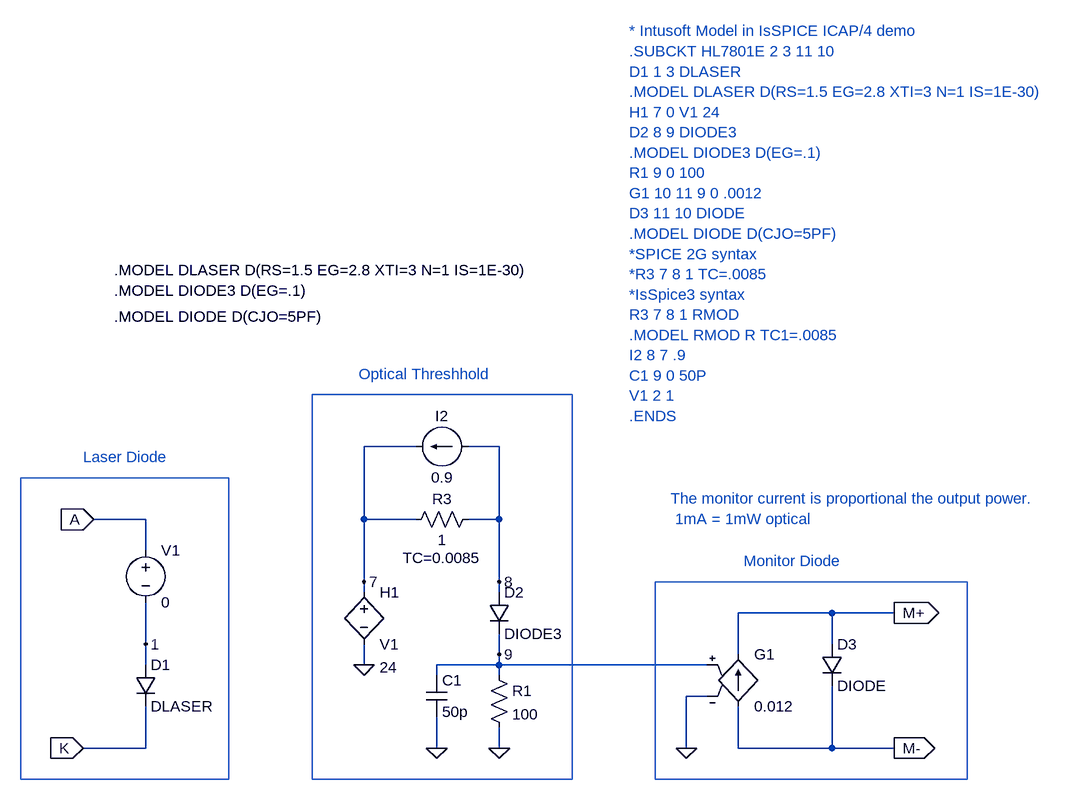
[diagram p0: schematic ld_hl7801e.asc]
ld_hl7801e.asc, the LTspice schematic file:
Version 4
SHEET 1 1556 1100
WIRE 16 288 16 256
WIRE 16 352 16 416
WIRE 16 256 16 192
WIRE 352 288 352 256
WIRE 352 176 352 160
WIRE 352 160 352 64
WIRE 560 176 560 160
WIRE 560 240 560 272
WIRE 560 160 560 64
WIRE 560 272 560 288
WIRE 560 384 560 416
WIRE 928 272 928 208
WIRE 928 352 928 416
WIRE 560 288 880 288
WIRE 560 288 560 304
WIRE 880 336 848 336
WIRE 848 336 848 416
WIRE 928 208 1072 208
WIRE 1072 208 1072 256
WIRE 928 416 1072 416
WIRE 1072 416 1072 320
WIRE 512 64 560 64
WIRE 432 64 352 64
WIRE 512 -48 560 -48
WIRE 560 -48 560 64
WIRE 432 -48 352 -48
WIRE 352 -48 352 64
WIRE 560 288 464 288
WIRE 464 288 464 304
WIRE 464 368 464 416
WIRE 16 112 16 64
WIRE 16 64 -64 64
WIRE 16 416 -80 416
WIRE 1072 208 1168 208
WIRE 1072 416 1168 416
FLAG 16 256 1
FLAG -80 416 K
IOPIN -80 416 In
FLAG 352 288 0
FLAG 352 160 7
FLAG 560 160 8
FLAG 560 272 9
FLAG 560 416 0
FLAG 1168 208 M+
IOPIN 1168 208 Out
FLAG 1168 416 M-
IOPIN 1168 416 Out
FLAG 848 416 0
FLAG 464 416 0
FLAG -64 64 A
IOPIN -64 64 In
SYMBOL diode 0 288 R0
SYMATTR InstName D1
SYMATTR Value DLASER
SYMBOL h 352 160 R0
WINDOW 39 24 132 Left 0
SYMATTR SpiceLine 24
SYMATTR InstName H1
SYMATTR Value V1
SYMBOL diode 544 176 R0
SYMATTR InstName D2
SYMATTR Value DIODE3
SYMBOL res 544 288 R0
SYMATTR InstName R1
SYMATTR Value 100
SYMBOL g 928 256 R0
SYMATTR InstName G1
SYMATTR Value 0.012
SYMBOL diode 1056 256 R0
SYMATTR InstName D3
SYMATTR Value DIODE
SYMBOL res 416 80 R270
WINDOW 0 32 56 VTop 0
WINDOW 3 0 56 VBottom 0
WINDOW 39 -28 56 VBottom 0
SYMATTR InstName R3
SYMATTR Value 1
SYMATTR SpiceLine TC=0.0085
SYMBOL current 512 -48 R90
WINDOW 0 -32 40 VBottom 0
WINDOW 3 32 40 VTop 0
SYMATTR InstName I2
SYMATTR Value 0.9
SYMBOL cap 448 304 R0
SYMATTR InstName C1
SYMATTR Value 50p
SYMBOL voltage 16 96 R0
SYMATTR InstName V1
SYMATTR Value 0
TEXT -32 -320 Left 0 !.MODEL DLASER D(RS=1.5 EG=2.8 XTI=3 N=1 IS=1E-30)
TEXT -32 -288 Left 0 !.MODEL DIODE3 D(EG=.1)
TEXT -32 -248 Left 0 !.MODEL DIODE D(CJO=5PF)
TEXT 760 -688 Left 0 ;* Intusoft Model in IsSPICE ICAP/4 demo\n.SUBCKT HL7801E 2 3 11 10\nD1 1 3 DLASER\n.MODEL DLASER D(RS=1.5 EG=2.8 XTI=3 N=1 IS=1E-30)      \nH1 7 0 V1 24\nD2 8 9 DIODE3\n.MODEL DIODE3 D(EG=.1)\nR1 9 0 100\nG1 10 11 9 0 .0012\nD3 11 10 DIODE\n.MODEL DIODE D(CJO=5PF)\n*SPICE 2G syntax\n*R3 7 8 1 TC=.0085\n*IsSpice3 syntax\nR3 7 8 1 RMOD\n.MODEL RMOD R TC1=.0085\nI2 8 7 .9\nC1 9 0 50P\nV1 2 1\n.ENDS
TEXT 824 32 Left 0 ;The monitor current is proportional the output power.\n 1mA = 1mW optical
TEXT 344 -160 Left 0 ;Optical Threshhold
TEXT 936 128 Left 0 ;Monitor Diode
TEXT -80 -32 Left 0 ;Laser Diode
RECTANGLE Normal 672 464 272 -128
RECTANGLE Normal 1280 464 800 160
RECTANGLE Normal 144 464 -176 0

The netlist it stands for:
* ld_hl7801e.asc
D1 1 K DLASER
H1 7 0 V1 24
D2 8 9 DIODE3
R1 9 0 100
G1 M- M+ 9 0 0.012
D3 M+ M- DIODE
R3 7 8 1 TC=0.0085
I2 8 7 0.9
C1 9 0 50p
V1 A 1 0
.model D D
.lib standard.dio
.MODEL DLASER D(RS=1.5 EG=2.8 XTI=3 N=1 IS=1E-30)
.MODEL DIODE3 D(EG=.1)
.MODEL DIODE D(CJO=5PF)
* * Intusoft Model in IsSPICE ICAP/4 demo
* .SUBCKT HL7801E 2 3 11 10
* D1 1 3 DLASER
* .MODEL DLASER D(RS=1.5 EG=2.8 XTI=3 N=1 IS=1E-30)
* H1 7 0 V1 24
* D2 8 9 DIODE3
* .MODEL DIODE3 D(EG=.1)
* R1 9 0 100
* G1 10 11 9 0 .0012
* D3 11 10 DIODE
* .MODEL DIODE D(CJO=5PF)
* *SPICE 2G syntax
* *R3 7 8 1 TC=.0085
* *IsSpice3 syntax
* R3 7 8 1 RMOD
* .MODEL RMOD R TC1=.0085
* I2 8 7 .9
* C1 9 0 50P
* V1 2 1
* .ENDS
* The monitor current is proportional the output power.
*  1mA = 1mW optical
* Optical Threshhold
* Monitor Diode
* Laser Diode
.backanno
.end